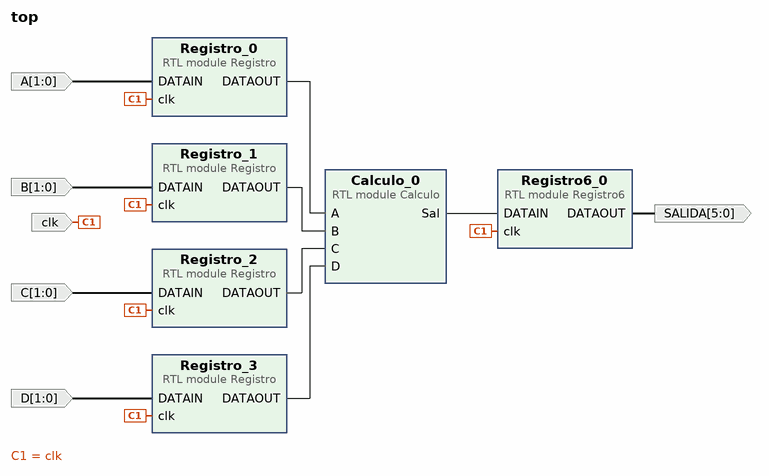
[diagram p0: block diagram of the top level]
# Vivado block design top, xc7a35tcpg236-1, Vivado 2016.4
create_bd_design top

create_bd_port -dir I -from 1 -to 0 A
create_bd_port -dir I -from 1 -to 0 B
create_bd_port -dir I -from 1 -to 0 C
create_bd_port -dir I -from 1 -to 0 D
create_bd_port -dir I -type clk clk
set_property -dict {CONFIG.FREQ_HZ 100000000} [get_bd_ports clk]
create_bd_port -dir O -from 5 -to 0 SALIDA

create_bd_cell -type module -reference Registro Registro_0
create_bd_cell -type module -reference Registro Registro_1
create_bd_cell -type module -reference Registro Registro_2
create_bd_cell -type module -reference Registro Registro_3
create_bd_cell -type module -reference Calculo Calculo_0
create_bd_cell -type module -reference Registro6 Registro6_0

# ---- connections ----

connect_bd_net [get_bd_pins Registro_0/DATAOUT] [get_bd_pins Calculo_0/A]
connect_bd_net [get_bd_pins Registro_1/DATAOUT] [get_bd_pins Calculo_0/B]
connect_bd_net [get_bd_pins Registro_2/DATAOUT] [get_bd_pins Calculo_0/C]
connect_bd_net [get_bd_pins Registro_3/DATAOUT] [get_bd_pins Calculo_0/D]
connect_bd_net [get_bd_pins Calculo_0/Sal] [get_bd_pins Registro6_0/DATAIN]
connect_bd_net [get_bd_ports A] [get_bd_pins Registro_0/DATAIN]
connect_bd_net [get_bd_ports B] [get_bd_pins Registro_1/DATAIN]
connect_bd_net [get_bd_ports C] [get_bd_pins Registro_2/DATAIN]
connect_bd_net [get_bd_ports D] [get_bd_pins Registro_3/DATAIN]
connect_bd_net [get_bd_ports clk] \
  [get_bd_pins Registro_0/clk] [get_bd_pins Registro_1/clk] [get_bd_pins Registro_2/clk] [get_bd_pins Registro_3/clk] \
  [get_bd_pins Registro6_0/clk]
connect_bd_net [get_bd_pins Registro6_0/DATAOUT] [get_bd_ports SALIDA]

validate_bd_design
save_bd_design
